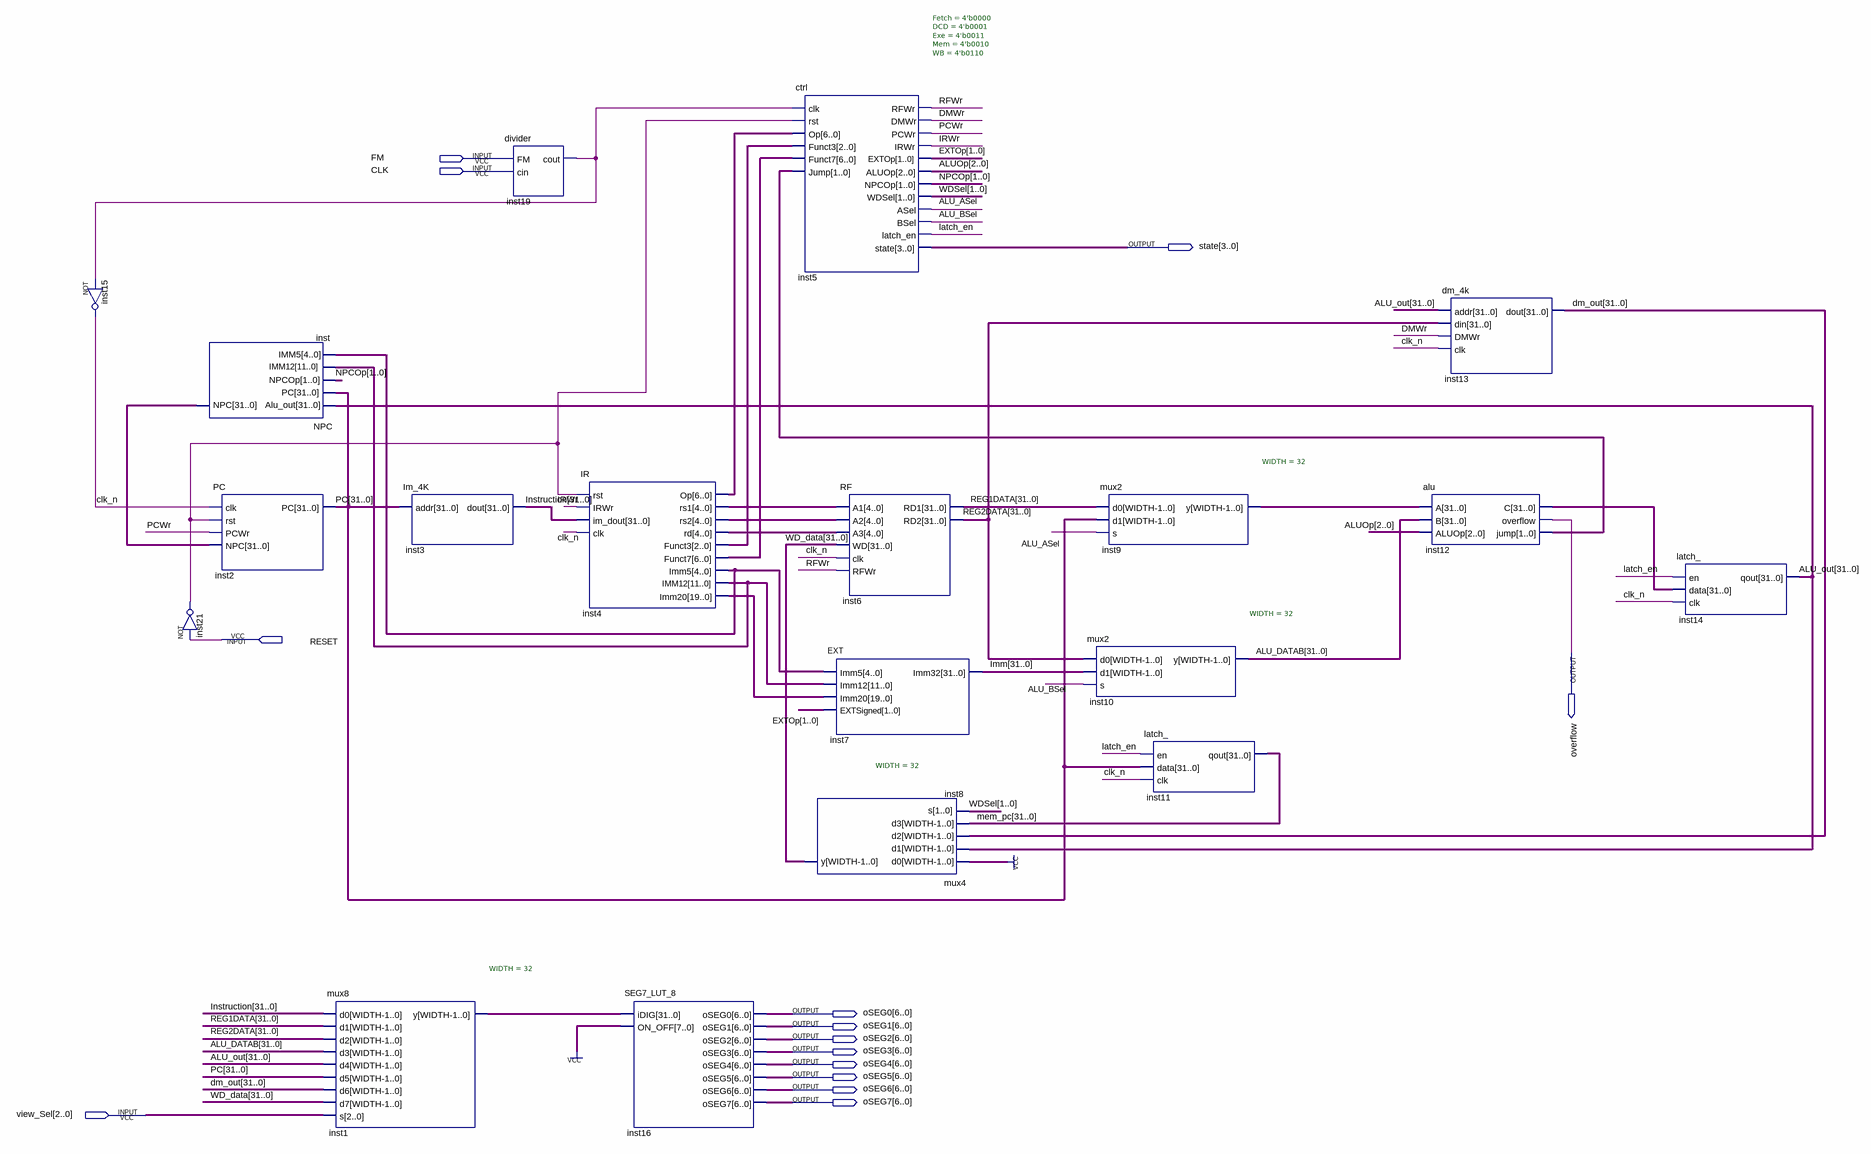
[diagram p0: schematic sheet]
// Quartus schematic CPU.bdf as structural Verilog: 19 symbols, 14 pins
module CPU (
  input  FM,
  input  CLK,
  input  RESET,
  input  [2:0] view_Sel,
  output [3:0] state,
  output overflow,
  output [6:0] oSEG0,
  output [6:0] oSEG1,
  output [6:0] oSEG2,
  output [6:0] oSEG3,
  output [6:0] oSEG4,
  output [6:0] oSEG5,
  output [6:0] oSEG6,
  output [6:0] oSEG7
);

  wire ALU_ASel, ALU_BSel, clk_n, DMWr, inst19_cout, inst21_out, IRWr, latch_en, PCWr, RFWr;
  wire [1:0] EXTOp, inst12_jump, NPCOp, WDSel;
  wire [2:0] ALUOp, inst4_funct3;
  wire [4:0] inst4_imm5, inst4_rd, inst4_rs1, inst4_rs2;
  wire [6:0] inst4_funct7, inst4_op;
  wire [11:0] inst4_imm12;
  wire [19:0] inst4_imm20;
  wire [31:0] ALU_DATAB, ALU_out, dm_out, Imm, inst1_y, inst9_y, inst12_c, inst_npc, Instruction, mem_pc, PC,
       REG1DATA, REG2DATA, WD_data;

  not inst15 (clk_n, inst19_cout);
  not inst21 (inst21_out, RESET);
  NPC inst (.Alu_out(ALU_out), .PC(PC), .NPCOp(NPCOp), .IMM12(inst4_imm12), .IMM5(inst4_imm5), .NPC(inst_npc));
  PC inst2 (.clk(clk_n), .rst(inst21_out), .PCWr(PCWr), .NPC(inst_npc), .PC(PC));
  mux8 #(.WIDTH(32)) inst1 (
    .d0(Instruction), .d1(REG1DATA), .d2(REG2DATA), .d3(ALU_DATAB), .d4(ALU_out), .d5(PC), .d6(dm_out),
    .d7(WD_data), .s(view_Sel), .y(inst1_y));
  Im_4K inst3 (.addr(PC), .dout(Instruction));
  divider inst19 (.FM(FM), .cin(CLK), .cout(inst19_cout));
  IR inst4 (
    .rst(inst21_out), .IRWr(IRWr), .im_dout(Instruction), .clk(clk_n), .Op(inst4_op), .rs1(inst4_rs1),
    .rs2(inst4_rs2), .rd(inst4_rd), .Funct3(inst4_funct3), .Funct7(inst4_funct7), .Imm5(inst4_imm5),
    .IMM12(inst4_imm12), .Imm20(inst4_imm20));
  SEG7_LUT_8 inst16 (
    .iDIG(inst1_y), .ON_OFF({8{1'b1}}), .oSEG0(oSEG0), .oSEG1(oSEG1), .oSEG2(oSEG2), .oSEG3(oSEG3),
    .oSEG4(oSEG4), .oSEG5(oSEG5), .oSEG6(oSEG6), .oSEG7(oSEG7));
  ctrl #(.Fetch(4'b0000), .DCD(4'b0001), .Exe(4'b0011), .Mem(4'b0010), .WB(4'b0110)) inst5 (
    .clk(inst19_cout), .rst(inst21_out), .Op(inst4_op), .Funct3(inst4_funct3), .Funct7(inst4_funct7),
    .Jump(inst12_jump), .RFWr(RFWr), .DMWr(DMWr), .PCWr(PCWr), .IRWr(IRWr), .EXTOp(EXTOp), .ALUOp(ALUOp),
    .NPCOp(NPCOp), .WDSel(WDSel), .ASel(ALU_ASel), .BSel(ALU_BSel), .latch_en(latch_en), .state(state));
  RF inst6 (
    .A1(inst4_rs1), .A2(inst4_rs2), .A3(inst4_rd), .WD(WD_data), .clk(clk_n), .RFWr(RFWr), .RD1(REG1DATA),
    .RD2(REG2DATA));
  EXT inst7 (.Imm5(inst4_imm5), .Imm12(inst4_imm12), .Imm20(inst4_imm20), .EXTSigned(EXTOp), .Imm32(Imm));
  mux4 #(.WIDTH(32)) inst8 (.d0({32{1'b1}}), .d1(ALU_out), .d2(dm_out), .d3(mem_pc), .s(WDSel), .y(WD_data));
  mux2 #(.WIDTH(32)) inst9 (.d0(REG1DATA), .d1(PC), .s(ALU_ASel), .y(inst9_y));
  mux2 #(.WIDTH(32)) inst10 (.d0(REG2DATA), .d1(Imm), .s(ALU_BSel), .y(ALU_DATAB));
  latch_ inst11 (.en(latch_en), .data(PC), .clk(clk_n), .qout(mem_pc));
  dm_4k inst13 (.addr(ALU_out), .din(REG2DATA), .DMWr(DMWr), .clk(clk_n), .dout(dm_out));
  alu inst12 (.A(inst9_y), .B(ALU_DATAB), .ALUOp(ALUOp), .C(inst12_c), .overflow(overflow), .jump(inst12_jump));
  latch_ inst14 (.en(latch_en), .data(inst12_c), .clk(clk_n), .qout(ALU_out));
endmodule
